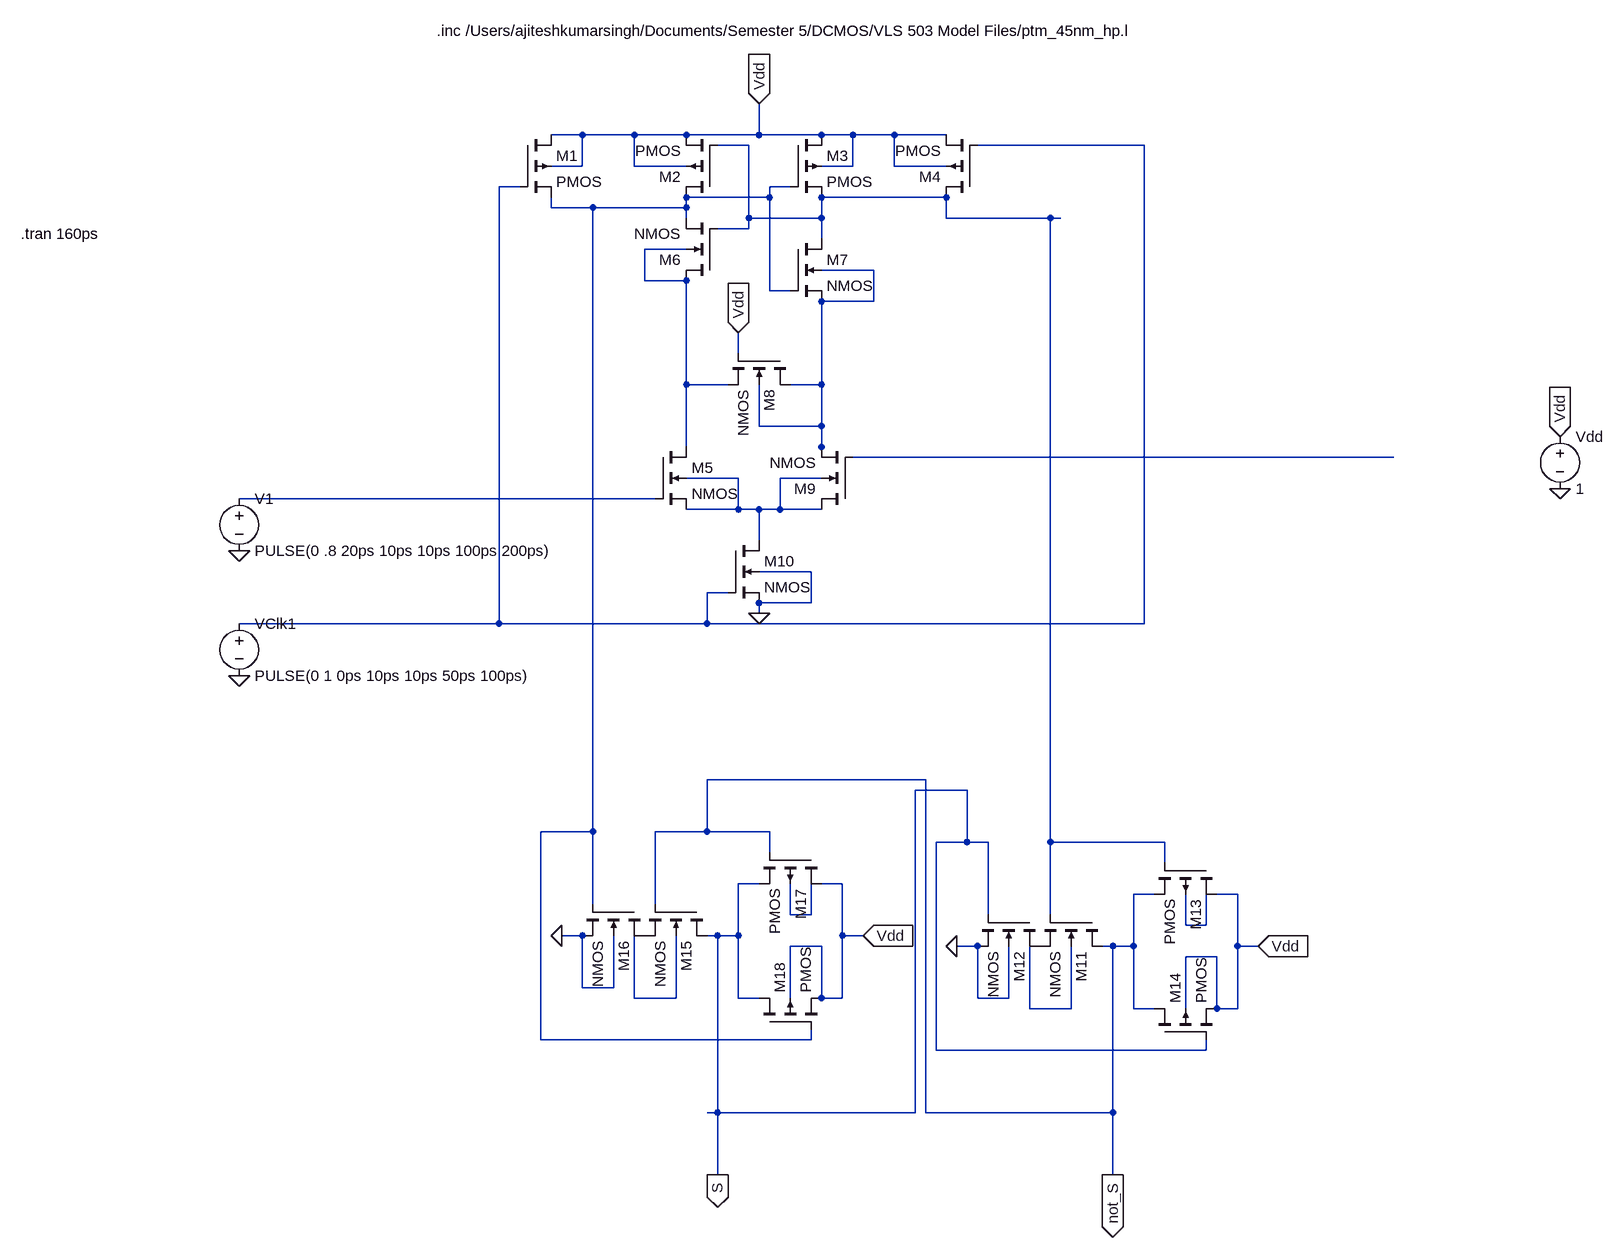
[diagram p0: schematic SAFF.asc]
SAFF.asc, the LTspice schematic file:
Version 4
SHEET 1 1428 2176
WIRE -160 464 -208 464
WIRE -80 464 -160 464
WIRE 0 464 -80 464
WIRE 112 464 112 416
WIRE 112 464 0 464
WIRE 208 464 112 464
WIRE 256 464 208 464
WIRE 320 464 256 464
WIRE 400 464 320 464
WIRE 96 480 48 480
WIRE 704 480 448 480
WIRE -160 512 -160 464
WIRE -160 512 -208 512
WIRE -80 512 -80 464
WIRE 0 512 -80 512
WIRE 256 512 256 464
WIRE 256 512 208 512
WIRE 320 512 320 464
WIRE 400 512 320 512
WIRE -256 544 -288 544
WIRE 160 544 128 544
WIRE 128 560 128 544
WIRE 128 560 0 560
WIRE 400 560 208 560
WIRE -208 576 -208 560
WIRE -144 576 -208 576
WIRE 0 576 0 560
WIRE 0 576 -144 576
WIRE 0 592 0 576
WIRE 96 592 96 480
WIRE 208 592 208 560
WIRE 208 592 96 592
WIRE 400 592 400 560
WIRE 560 592 400 592
WIRE 576 592 560 592
WIRE 96 608 96 592
WIRE 96 608 48 608
WIRE 208 624 208 592
WIRE 0 640 -64 640
WIRE 288 672 208 672
WIRE -64 688 -64 640
WIRE 0 688 -64 688
WIRE 128 704 128 560
WIRE 160 704 128 704
WIRE 288 720 288 672
WIRE 288 720 208 720
WIRE 80 800 80 768
WIRE 0 848 0 688
WIRE 64 848 0 848
WIRE 208 848 208 720
WIRE 208 848 160 848
WIRE 112 912 112 848
WIRE 208 912 208 848
WIRE 208 912 112 912
WIRE 0 944 0 848
WIRE 208 944 208 912
WIRE 208 960 208 944
WIRE 1088 960 256 960
WIRE 80 992 0 992
WIRE 208 992 144 992
WIRE -48 1024 -688 1024
WIRE 80 1040 80 992
WIRE 80 1040 0 1040
WIRE 112 1040 80 1040
WIRE 144 1040 144 992
WIRE 144 1040 112 1040
WIRE 208 1040 144 1040
WIRE 112 1088 112 1040
WIRE 192 1136 112 1136
WIRE 64 1168 32 1168
WIRE 192 1184 192 1136
WIRE 192 1184 112 1184
WIRE 112 1200 112 1184
WIRE -288 1216 -288 544
WIRE -288 1216 -688 1216
WIRE 32 1216 32 1168
WIRE 32 1216 -288 1216
WIRE 704 1216 704 480
WIRE 704 1216 32 1216
WIRE 368 1456 32 1456
WIRE 432 1472 352 1472
WIRE -144 1536 -144 576
WIRE -144 1536 -224 1536
WIRE 32 1536 32 1456
WIRE 32 1536 -48 1536
WIRE 128 1536 32 1536
WIRE 432 1552 432 1472
WIRE 432 1552 384 1552
WIRE 464 1552 432 1552
WIRE 560 1552 560 592
WIRE 736 1552 560 1552
WIRE 128 1568 128 1536
WIRE 736 1584 736 1552
WIRE 112 1616 80 1616
WIRE 240 1616 208 1616
WIRE 720 1632 688 1632
WIRE 848 1632 816 1632
WIRE -144 1648 -144 1536
WIRE -48 1648 -48 1536
WIRE 160 1664 160 1616
WIRE 192 1664 192 1616
WIRE 192 1664 160 1664
WIRE 464 1664 464 1552
WIRE 560 1664 560 1552
WIRE 768 1680 768 1632
WIRE 800 1680 800 1632
WIRE 800 1680 768 1680
WIRE -160 1696 -192 1696
WIRE 48 1696 32 1696
WIRE 80 1696 80 1616
WIRE 80 1696 48 1696
WIRE 240 1696 240 1616
WIRE 272 1696 240 1696
WIRE 208 1712 160 1712
WIRE 448 1712 416 1712
WIRE 656 1712 640 1712
WIRE 688 1712 688 1632
WIRE 688 1712 656 1712
WIRE 848 1712 848 1632
WIRE 880 1712 848 1712
WIRE 816 1728 768 1728
WIRE -160 1776 -160 1696
WIRE -112 1776 -112 1696
WIRE -112 1776 -160 1776
WIRE -80 1792 -80 1696
WIRE -16 1792 -16 1696
WIRE -16 1792 -80 1792
WIRE 80 1792 80 1696
WIRE 112 1792 80 1792
WIRE 160 1792 160 1712
WIRE 208 1792 208 1712
WIRE 240 1792 240 1696
WIRE 240 1792 208 1792
WIRE 448 1792 448 1712
WIRE 496 1792 496 1712
WIRE 496 1792 448 1792
WIRE 528 1808 528 1712
WIRE 592 1808 592 1712
WIRE 592 1808 528 1808
WIRE 688 1808 688 1712
WIRE 720 1808 688 1808
WIRE 768 1808 768 1728
WIRE 816 1808 816 1728
WIRE 848 1808 848 1712
WIRE 848 1808 816 1808
WIRE -224 1856 -224 1536
WIRE 192 1856 192 1840
WIRE 192 1856 -224 1856
WIRE 384 1872 384 1552
WIRE 800 1872 800 1856
WIRE 800 1872 384 1872
WIRE 48 1968 48 1696
WIRE 48 1968 32 1968
WIRE 352 1968 352 1472
WIRE 352 1968 48 1968
WIRE 368 1968 368 1456
WIRE 656 1968 656 1712
WIRE 656 1968 368 1968
WIRE 48 2064 48 1968
WIRE 656 2064 656 1968
FLAG 112 1200 0
FLAG 112 416 Vdd
IOPIN 112 416 In
FLAG -688 1296 0
FLAG -688 1104 0
FLAG 80 768 Vdd
IOPIN 80 768 In
FLAG 272 1696 Vdd
IOPIN 272 1696 In
FLAG -192 1696 0
FLAG 880 1712 Vdd
IOPIN 880 1712 In
FLAG 416 1712 0
FLAG 1344 1008 0
FLAG 1344 928 Vdd
IOPIN 1344 928 In
FLAG 48 2064 S
IOPIN 48 2064 Out
FLAG 656 2064 not_S
IOPIN 656 2064 Out
SYMBOL pmos4 -256 464 R0
SYMATTR InstName M1
SYMATTR Value2 l=45n w=90n
SYMBOL pmos4 48 560 R180
SYMATTR InstName M2
SYMATTR Value2 l=45n w=90n
SYMBOL pmos4 160 464 R0
SYMATTR InstName M3
SYMATTR Value2 l=45n w=90n
SYMBOL pmos4 448 560 R180
SYMATTR InstName M4
SYMATTR Value2 l=45n w=90n
SYMBOL nmos4 -48 944 R0
SYMATTR InstName M5
SYMATTR Value2 l=45n w=60n
SYMBOL nmos4 48 688 R180
SYMATTR InstName M6
SYMATTR Value2 l=45n w=60n
SYMBOL nmos4 160 624 R0
SYMATTR InstName M7
SYMATTR Value2 l=45n w=60n
SYMBOL nmos4 160 800 R90
SYMATTR InstName M8
SYMATTR Value2 l=45n w=75n
SYMBOL nmos4 256 1040 R180
SYMATTR InstName M9
SYMATTR Value2 l=45n w=60n
SYMBOL nmos4 64 1088 R0
SYMATTR InstName M10
SYMATTR Value2 l=45n w=45n
SYMBOL voltage -688 1200 R0
SYMATTR InstName VClk1
SYMATTR Value PULSE(0 1 0ps 10ps 10ps 50ps 100ps)
SYMBOL voltage -688 1008 R0
SYMATTR InstName V1
SYMATTR Value PULSE(0 .8 20ps 10ps 10ps 100ps 200ps)
SYMBOL nmos4 32 1648 R90
SYMATTR InstName M15
SYMATTR Value2 l=45nm w=90nm
SYMBOL nmos4 -64 1648 R90
SYMATTR InstName M16
SYMATTR Value2 l=45nm w=90nm
SYMBOL pmos4 208 1568 R90
SYMATTR InstName M17
SYMATTR Value2 l=45nm w=90nm
SYMBOL pmos4 112 1840 R270
SYMATTR InstName M18
SYMATTR Value2 l=45nm w=90nm
SYMBOL nmos4 640 1664 R90
SYMATTR InstName M11
SYMATTR Value2 l=45nm w=90nm
SYMBOL nmos4 544 1664 R90
SYMATTR InstName M12
SYMATTR Value2 l=45nm w=90nm
SYMBOL pmos4 816 1584 R90
SYMATTR InstName M13
SYMATTR Value2 l=45nm w=90nm
SYMBOL pmos4 720 1856 R270
SYMATTR InstName M14
SYMATTR Value2 l=45nm w=90nm
SYMBOL voltage 1344 912 R0
SYMATTR InstName Vdd
SYMATTR Value 1
TEXT -384 304 Left 2 !.inc /Users/ajiteshkumarsingh/Documents/Semester 5/DCMOS/VLS 503 Model Files/ptm_45nm_hp.l
TEXT -1024 616 Left 2 !.tran 160ps

The netlist it stands for:
* SAFF.asc
M1 Vdd N002 N003 Vdd PMOS l=45n w=90n
M2 N003 N001 Vdd Vdd PMOS l=45n w=90n
M3 Vdd N003 N001 Vdd PMOS l=45n w=90n
M4 N001 N002 Vdd Vdd PMOS l=45n w=90n
M5 N004 N008 N007 N007 NMOS l=45n w=60n
M6 N004 N001 N003 N004 NMOS l=45n w=60n
M7 N001 N003 N005 N005 NMOS l=45n w=60n
M8 N005 Vdd N004 N005 NMOS l=45n w=75n
M9 N007 N006 N005 N007 NMOS l=45n w=60n
M10 N007 N002 0 0 NMOS l=45n w=45n
VClk1 N002 0 PULSE(0 1 0ps 10ps 10ps 50ps 100ps)
V1 N008 0 PULSE(0 .8 20ps 10ps 10ps 100ps 200ps)
M15 S not_S P001 N011 NMOS l=45nm w=90nm
M16 P001 N003 0 0 NMOS l=45nm w=90nm
M17 Vdd not_S S N009 PMOS l=45nm w=90nm
M18 S N003 Vdd Vdd PMOS l=45nm w=90nm
M11 not_S N001 P002 N012 NMOS l=45nm w=90nm
M12 P002 S 0 0 NMOS l=45nm w=90nm
M13 Vdd N001 not_S N010 PMOS l=45nm w=90nm
M14 not_S S Vdd Vdd PMOS l=45nm w=90nm
Vdd Vdd 0 1
.model NMOS NMOS
.model PMOS PMOS
.lib standard.mos
.inc /Users/ajiteshkumarsingh/Documents/Semester 5/DCMOS/VLS 503 Model Files/ptm_45nm_hp.l
.tran 160ps
.backanno
.end